# EasyEDA Pro project 基于ESP32智能动植物养护调控系统_2026-06-21.epro, schematic Schematic1
Board Name: Board1; Create Date: 2025-03-10; Page Name: P1; Project Name: 基于ESP32的环境检测器; Schematic Name: Schematic1; Update Date: 2025-03-11; Company: 嘉立创EDA; Page Size: A4; Version: V1.0
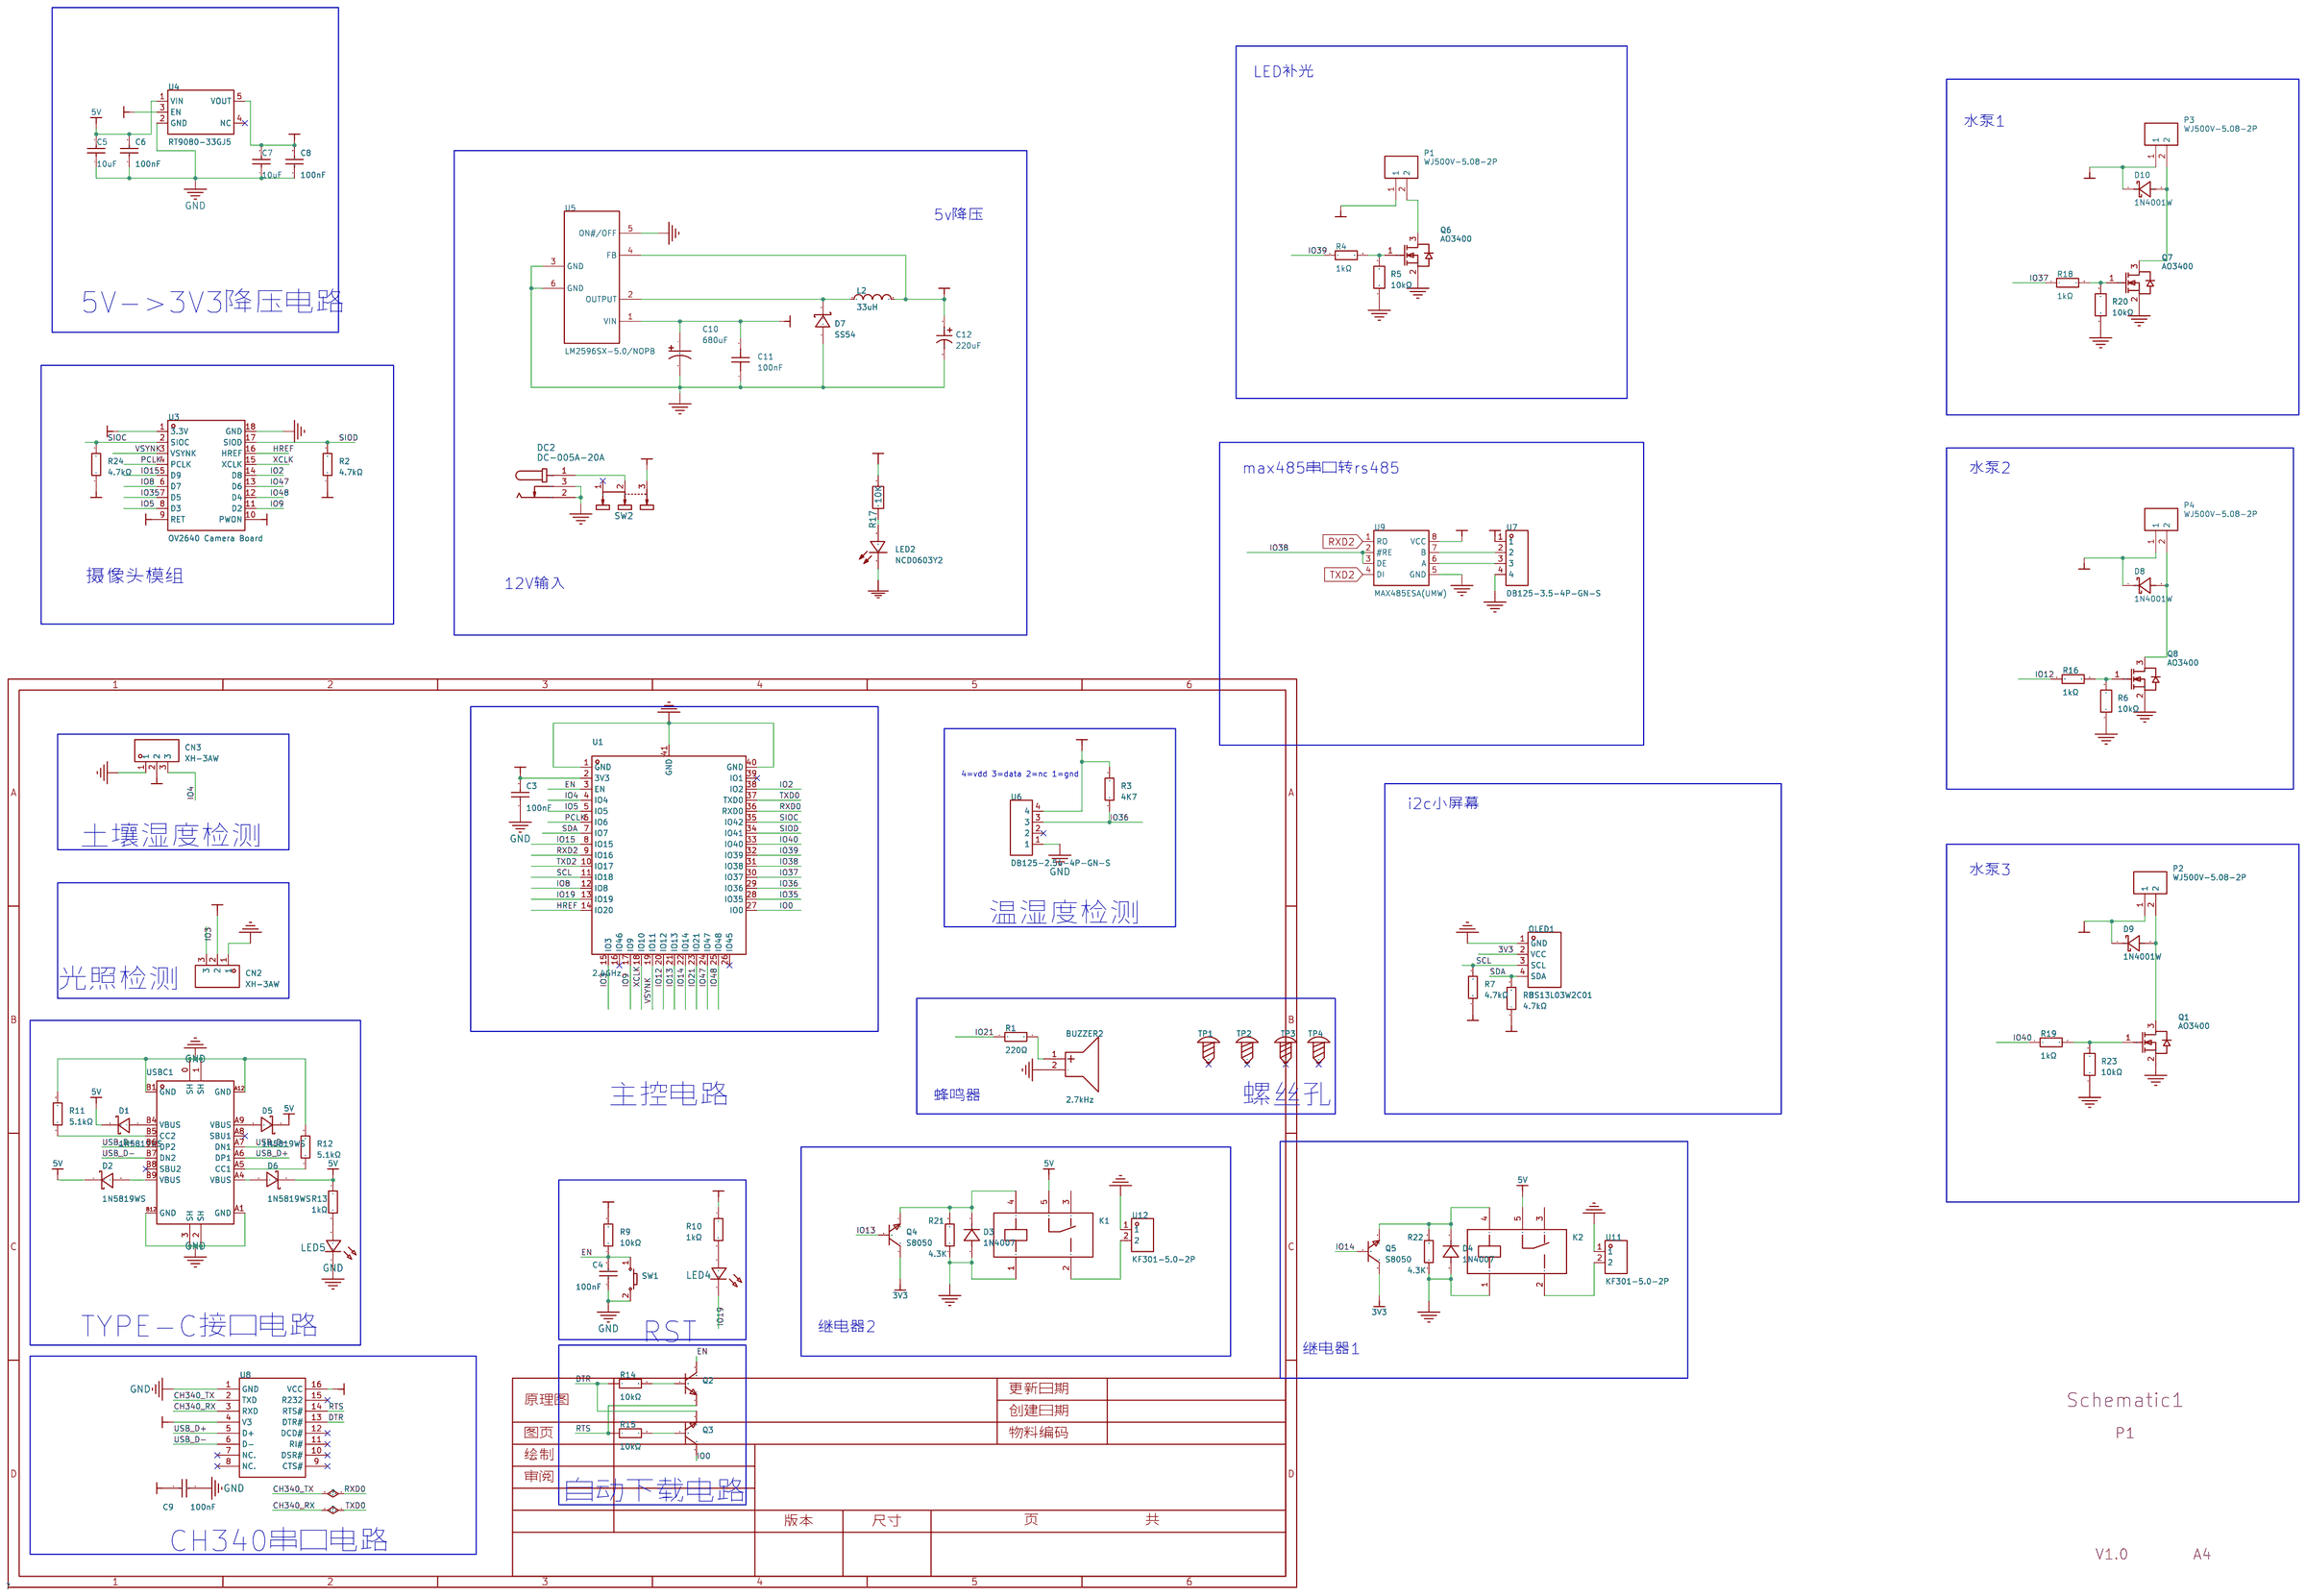
[diagram p0: schematic sheet]

## Parts
BUZZER2  2.7kHz  [BUZ-SMD_GSD9605YB-3V2800]
C3  100nF  [C0805]
C4  100nF  [C0805]
C5  10uF  [C0805]
C6  100nF  [C0805]
C7  10uF  [C0805]
C8  100nF  [C0805]
C9  100nF  [C0805]
C10  680uF  [CAP-SMD_BD12.5-L13.0-W13.0-FD]
C11  100nF  [C0805]
C12  220uF  [CAP-SMD_BD6.3-L6.6-W6.6-LS7.2-FD]
CN2  XH-3AW  [CONN-TH_3P-P2.54_HCTL_XH-3AW]
CN3  XH-3AW  [CONN-TH_3P-P2.54_HCTL_XH-3AW]
D1  1N5819WS  [SOD-323_L1.8-W1.3-LS2.5-RD]
D2  1N5819WS  [SOD-323_L1.8-W1.3-LS2.5-RD]
D3  1N4007  [SMA_L4.3-W2.5-LS5.0-RD]
D4  1N4007  [SMA_L4.3-W2.5-LS5.0-RD]
D5  1N5819WS  [SOD-323_L1.8-W1.3-LS2.5-RD]
D6  1N5819WS  [SOD-323_L1.8-W1.3-LS2.5-RD]
D7  SS54  [SMA_L4.4-W2.8-LS5.4-R-RD]
D8  1N4001W  [SOD-123FL_L2.7-W1.8-LS3.8-RD]
D9  1N4001W  [SOD-123FL_L2.7-W1.8-LS3.8-RD]
D10  1N4001W  [SOD-123FL_L2.7-W1.8-LS3.8-RD]
DC2  DC-005A-20A  [DC-IN-TH_DC-005A-20A]
K1  SRD-03VDC-SL-C  [RELAY-TH_SRD-XXVDC-XL-C]
K2  SRD-03VDC-SL-C  [RELAY-TH_SRD-XXVDC-XL-C]
L2  33uH  [IND-SMD_L7.3-W6.8]
LED2  NCD0603Y2  [LED0603-RD]
LED4  -  [LED_0805]
LED5  -  [LED_0805]
OLED1  HS13L03W2C01  [OLED-TH_L35.4-W33.5_HS13L03W2C01]
P1  WJ500V-5.08-2P  [CONN-TH_2P-P5.00_WJ500V-5.08-2P]
P2  WJ500V-5.08-2P  [CONN-TH_2P-P5.00_WJ500V-5.08-2P]
P3  WJ500V-5.08-2P  [CONN-TH_2P-P5.00_WJ500V-5.08-2P]
P4  WJ500V-5.08-2P  [CONN-TH_2P-P5.00_WJ500V-5.08-2P]
Q1  AO3400  [SOT-23_L2.9-W1.3-P1.90-LS2.4-BR]
Q2  SS8050  [SOT-23-3_L2.9-W1.3-P1.90-LS2.4-BR]
Q3  SS8050  [SOT-23-3_L2.9-W1.3-P1.90-LS2.4-BR]
Q4  S8050  [SOT-23-3_L2.9-W1.3-P1.90-LS2.3-BR]
Q5  S8050  [SOT-23-3_L2.9-W1.3-P1.90-LS2.3-BR]
Q6  AO3400  [SOT-23_L2.9-W1.3-P1.90-LS2.4-BR]
Q7  AO3400  [SOT-23_L2.9-W1.3-P1.90-LS2.4-BR]
Q8  AO3400  [SOT-23_L2.9-W1.3-P1.90-LS2.4-BR]
R1  220Ω  [R0805]
R2  4.7kΩ  [R0805]
R3  4K7  [R0805]
R4  1kΩ  [R0603]
R5  10kΩ  [R0603]
R6  10kΩ  [R0603]
R7  4.7kΩ  [R0805]
R8  4.7kΩ  [R0805]
R9  10kΩ  [R0805]
R10  1kΩ  [R0805]
R11  5.1kΩ  [R0805]
R12  5.1kΩ  [R0805]
R13  1kΩ  [R0805]
R14  10kΩ  [R0805]
R15  10kΩ  [R0805]
R16  1kΩ  [R0603]
R17  10K  [R0603]
R18  1kΩ  [R0603]
R19  1kΩ  [R0603]
R20  10kΩ  [R0603]
R21  4.3K  [R0805]
R22  4.3K  [R0805]
R23  10kΩ  [R0603]
R24  4.7kΩ  [R0805]
SW1  -  [Key_SMD_3.6x6.1x2.5]
SW2  SS-12D10L3  [SW-TH_SS-12D10L3]
TP1  -  [M3螺丝]
TP2  -  [M3螺丝]
TP3  -  [M3螺丝]
TP4  -  [M3螺丝]
U1  2.4GHz  [WIRELM-SMD_ESP32-S3-WROOM-1]
U3  OV2640 Camera Board  [SENSORM-TH_L35.7-W3.9-OV2640]
U4  RT9080-33GJ5  [SOT-23-5_L3.0-W1.5-P0.95-LS2.8-BL]
U5  LM2596SX-5.0/NOPB  [TO-263-5_L10.2-W8.9-P1.70-TL]
U6  DB125-2.54-4P-GN-S  [CONN-TH_DB125-2.54-4P-GN]
U7  DB125-3.5-4P-GN-S  [CONN-TH_DB125-3.5-4P-GN]
U8  CH340C  [SOP-16_L10.0-W3.9-P1.27-LS6.0-BL]
U9  MAX485ESA(UMW)  [SOP-8_L5.0-W4.0-P1.27-LS6.0-BL]
U11  KF301-5.0-2P  [CONN-TH_P5.00_KF301-5.0-2P]
U12  KF301-5.0-2P  [CONN-TH_P5.00_KF301-5.0-2P]
USBC1  TYPE-C-31-M-12  [USB-C_SMD-TYPE-C-31-M-12]

## Library data of the parts
BUZZER2 = GSD9605YB-3V2800: 驱动方式:有源(内含驱动线路);构造类型:电磁式;频率:2.7kHz;声压(SPL):80dB;; LCSC Part Name: 9.6*9.6*5mm电磁有源 3V; Supplier Part: C255327; Manufacturer: INGHAi(赢海); JLCPCB Part Class: Extended Part; Datasheet: https://item.szlcsc.com/datasheet/GSD9605YB-3V2800/249279.html; Supplier: LCSC; Driver Circuitry: 有源(内含驱动线路); Technology: 电磁式; Voltage - Supply: 2V~5V; Sound Pressure Level(SPL): 80dB; Length: 9.6mm; Width: 9.6mm; Height: 5.2mm
C3 C4 C6 C8 C9 = 0805B104K500NT: 容值:100nF;精度:±10%;额定电压:50V;材质(温度系数):X7R;; LCSC Part Name: 100nF±10%50V; Supplier Part: C38141; Manufacturer: FH(风华); Supplier Footprint: 0805; JLCPCB Part Class: ExtendedPart; Datasheet: https://atta.szlcsc.com/upload/public/pdf/source/20170923/C38141_1506149447419988747.pdf; Supplier: LCSC; Tolerance: ±10%; Voltage Rated: 50V; Temperature Coefficient: X7R
C5 C7 = CL21A106KAYNNNE_C15850: 容值:10uF;精度:±10%;额定电压:25V;材质(温度系数):X5R;; LCSC Part Name: 10uF±10%25V; Supplier Part: C15850; Manufacturer: SAMSUNG(三星); Manufacturer Part: CL21A106KAYNNNE; Supplier Footprint: 0805; JLCPCB Part Class: BasicPart; Datasheet: https://atta.szlcsc.com/upload/public/pdf/source/20160103/1457707679302.pdf; Supplier: LCSC; Tolerance: ±10%; Voltage Rated: 25V; Temperature Coefficient: X5R
C10 = 35TLV680M12.5X13.5: 容值:680uF;精度:±20%;额定电压:35V;纹波电流:660mA@120Hz;等效串联电阻:-;; LCSC Part Name: 680uF ±20% 35V; Supplier Part: C201215; Manufacturer: rubycon(红宝石); Supplier Footprint: SMD,D12.5xL13.5mm; JLCPCB Part Class: Extended Part; Datasheet: https://atta.szlcsc.com/upload/public/pdf/source/20180329/C201215_4AB8F271E64CA7663E2E6376398CC492.pdf; Supplier: LCSC; Tolerance: ±20%; Rated Voltage: 35V; Ripple Current: 660mA@120Hz; φD: 12.5mm; L: 13.5mm; Lifetime @ Temp: 5000hrs@105℃; Operating Temperature: -55℃~+105℃
C11 = CAP_0805: Supplier Footprint: 0805
C12 = MVG 16V 220UF 6.3*7.7: 容值:220uF;精度:±20%;额定电压:16V;纹波电流:130mA@120Hz;等效串联电阻(ESR):-;; LCSC Part Name: 220uF ±20% 16V; Supplier Part: C2827940; Manufacturer: SAMYOUNG(韩国三莹); Supplier Footprint: SMD,D6.3xL7.7mm; JLCPCB Part Class: Extended Part; Datasheet: https://item.szlcsc.com/datasheet/MVG%252016V%2520220UF%25206.3*7.7/2975110.html; Supplier: LCSC; Tolerance: ±20%; Voltage Rating: 16V; Ripple Current: 130mA@120Hz; Diameter: 6.3mm; Height - Seated (Max): 7.7mm; Lifetime: 2000hrs@85℃; Operating Temperature: -40℃~+85℃
CN2 CN3 = XH-3AW_C2908612: 插针结构:1x3P;间距:2.54mm;安装方式:弯插;参考系列:XH;总PIN数:3P;排数:1;每排PIN数:3;行距:-;额定电流:3A;触头材质:黄铜;触头镀层:锡;工作温度:-25℃~+85℃;; LCSC Part Name: 1x3P 间距:2.54mm 弯插 系列:XH; Supplier Part: C2908612; Manufacturer: HCTL(华灿天禄); Supplier Footprint: 弯插,P=2.5mm; JLCPCB Part Class: Extended Part; Datasheet: https://item.szlcsc.com/datasheet/XH-3AW/3184383.html; Supplier: LCSC; Pins Structure: 1x3P; Pitch: 2.54mm; Mounting Type: 弯插; Reference Series: XH; Number of Pins: 3P; Number of Rows: 1; Number of PINs Per Row: 3; Current Rating: 3A; Contact Material: 黄铜; Contact Plating: 锡; Operating Temperature: -25℃~+85℃; Voltage Rating: 250V; Plastic Material: PA66; Flame Retardant Rating: UL94V-0; Z-Height of the Board: 5.9mm; Y-Width of Bottom Edge on Board: 7mm
D1 D2 D5 D6 = 1N5819WS_C191023: 正向压降(Vf):600mV@1A;直流反向耐压(Vr):40V;整流电流:1A;; LCSC Part Name: 电压:40V 电流:1A; Supplier Part: C191023; Manufacturer: Hottech(合科泰); Supplier Footprint: SOD-323; JLCPCB Part Class: Basic Part; Datasheet: https://item.szlcsc.com/datasheet/1N5819WS/213850.html; Supplier: LCSC; Voltage - Forward(Vf@If): 600mV@1A; Voltage - DC Reverse(Vr): 40V; Current - Rectified: 1A; Non-Repetitive Peak Forward Surge Current: 25A
D3 D4 = 1N4007_C727081: 二极管配置:独立式;正向压降(Vf):1.1V@1A;直流反向耐压(Vr):1kV;整流电流:1A;; Supplier Part: C727081; Manufacturer: TWGMC(台湾迪嘉); Supplier Footprint: SMA(DO-214AC); JLCPCB Part Class: 扩展库; Datasheet: https://atta.szlcsc.com/upload/public/pdf/source/20200828/C727079_3A05254382567072883400655AE0ED46.pdf; Supplier: LCSC; Diode Configuration: 独立式; Forward Voltage (Vf@If): 1.1V@1A; Reverse Voltage (Vr): 1kV; Rectified Current: 1A; Reverse Leakage Current (Ir): 5uA
D7 = SS54_C22452: 二极管配置:独立式;正向压降(Vf):550mV@5A;直流反向耐压(Vr):40V;整流电流:5A;; LCSC Part Name: 电压:40V 电流:5A; Supplier Part: C22452; Manufacturer: MDD(辰达半导体); Supplier Footprint: SMA(DO-214AC); JLCPCB Part Class: Basic Part; Datasheet: https://item.szlcsc.com/datasheet/SS54/23178.html; Supplier: LCSC; Diode Configuration: 独立式; Voltage - Forward(Vf@If): 550mV@5A; Voltage - DC Reverse(Vr): 40V; Current - Rectified: 5A; Reverse Leakage Current (Ir): 1mA@40V; Operating Junction Temperature Range: -55℃~+125℃
D8-D10 = 1N4001W_C18199085: 二极管配置:独立式;正向压降(Vf):1V@1.0A;直流反向耐压(Vr):50V;整流电流:1A;; Supplier Part: C18199085; Manufacturer: R+O(宏嘉诚); Supplier Footprint: SOD-123FL; JLCPCB Part Class: Extended Part; Datasheet: https://item.szlcsc.com/datasheet/1N4001W/19354317.html; Supplier: LCSC; Diode Configuration: 独立式; Voltage - Forward(Vf@If): 1V@1.0A; Voltage - DC Reverse(Vr): 50V; Current - Rectified: 1A; Reverse Leakage Current (Ir): 2uA@50V; Non-Repetitive Peak Forward Surge Current: 30A; Operating Junction Temperature Range: -55℃~+150℃
DC2 = DC-005A-20A: Supplier: LCSC; Supplier Part: C191049; Manufacturer: Rectangular Connectors - Contacts; JLCPCB Part Class: Extended Part
K1 K2 = SRD-03VDC-SL-C: 线圈电压:3V;触点形式:一组转换:1C(单刀双掷-转换);触点容量(电阻负载):-;最大切换电压:250V@AC;最大切换电流:15A;; LCSC Part Name: 蓝色; Supplier Part: C24585; Manufacturer: 松乐; Supplier Footprint: 插件,15.6x19.2mm; JLCPCB Part Class: 扩展库; Datasheet: https://atta.szlcsc.com/upload/public/pdf/source/20200305/C490149_C96E4098A3B1FFB377D5AD2E40B7C2A8.pdf; Supplier: LCSC; Coil Voltage: 3V; Contact Form: 一组转换:1C(单刀双掷-转换); Pin Number: 5; Maximum Switching Voltage: 250V@AC; Coil Rated Power: 360mW; Maximum Switching Current: 15A; Coil Type: 无极性-单线圈; Contact Resistance: 100mΩ; Operate Time: 10ms; Release Time: 10ms
L2 = FXL0630-100-M: 电感值:10uH;精度:±20%;额定电流:4.5A;饱和电流(Isat):5.5A;类型:一体成型电感;; LCSC Part Name: 10uH ±20% 5.5A; Supplier Part: C167223; Manufacturer: cjiang(长江微电); Supplier Footprint: SMD,7x6.6mm; JLCPCB Part Class: Extended Part; Datasheet: https://item.szlcsc.com/datasheet/FXL0630-100-M/178606.html; Supplier: LCSC; Tolerance: ±20%; Current Rating: 4.5A; Current - Saturation(Isat): 5.5A; DC Resistance(DCR): 68mΩ; Type: 一体成型电感
LED2 = NCD0603Y2: 灯头类型:-;发光颜色:黄色;正向压降(Vf):1.6V~2.6V;功率:65mW;正向电流:25mA;波长:586nm~595nm;二极管配置:独立二极管;透镜颜色:-;色温:-;发光强度:220mcd;发光角度:130°;载带方式:-;工作温度:-30℃~+85℃;; LCSC Part Name: 片式发光二极管; Supplier Part: C89811; Manufacturer: 国星光电; Supplier Footprint: 0603; JLCPCB Part Class: Extended Part; Datasheet: https://item.szlcsc.com/datasheet/NCD0603Y2/90993.html; Supplier: LCSC; Illumination Color: 黄色; Voltage - Forward(Vf): 1.6V~2.6V; Power(Watts): 65mW; Forward Current: 25mA; Wavelength - Dominant: 586nm~595nm; Peak Wavelength: 595nm; Diode Configuration: 独立二极管; Luminous Intensity: 220mcd; Viewing Angle: 130°; Operating Temperature: -30℃~+85℃
LED4 LED5 = LED_0805-R: Supplier Footprint: 0805; Supplier Part: C84256
OLED1 = HS13L03W2C01: 主控芯片:SH1106;接口类型:I2C;尺寸(inch):1.3;; LCSC Part Name: 1.3'1.3寸 128*64 OLED显示屏 I2C通讯 SH1106 白光; Supplier Part: C7465997; Manufacturer: HS(汉昇); JLCPCB Part Class: Extended Part; Datasheet: https://atta.szlcsc.com/upload/public/pdf/source/20230720/8731A47396DED074CDCD72E9ACEFB46F.pdf; Supplier: LCSC; Main Control Chip: SH1106; Interface Type: I2C; Size: 1.3; Operating Temperature: -40℃~+70℃
P1-P4 = WJ500V-5.08-2P: 结构:1x2P;间距:5.08mm;颜色:绿色;安装方式:直插;额定电流:18A;额定电压:250V;排数:1;线规 - AWG:14~30;线规 - 平方毫米:2.5;每排PIN数:2;触头材质:-;触头镀层:-;工作温度范围:-40℃~+105℃;焊接温度(最大值):-;; LCSC Part Name: 1x2P 5.08mm 直插 排数:1 每排P数:2; Supplier Part: C8465; Manufacturer: KANGNEX(康奈克斯电气); Supplier Footprint: 插件,P=5.08mm; JLCPCB Part Class: Extended Part; Datasheet: https://atta.szlcsc.com/upload/public/pdf/source/20191225/C8465_02D34CE5B5B4A53DF5891601D97FA9F4.pdf; Supplier: LCSC; Structure: 1x2P; Pitch: 5.08mm; Color: 绿色; Mounting Style: 直插; Current Rating (Max): 18A; Voltage Rating (Max): 250V; Number of Pins: 2P; Number of Rows: 1; Wire Gauge - AWG: 14~30; Wire Gauge - mm2: 2.5; Number of PINs Per Row: 2; Operating Temperature Range: -40℃~+105℃; Screw Specification: M2.5
Q1 Q6-Q8 = AO3400_C2938367: 数量:1个N沟道;漏源电压(Vdss):30V;连续漏极电流(Id):5.8A;导通电阻(RDS(on)):28mΩ@10V;耗散功率(Pd):1.5W;阈值电压(Vgs(th)):1.4V@250uA;; LCSC Part Name: 1个N沟道 耐压:30V 电流:5.8A; Supplier Part: C2938367; Manufacturer: GOODWORK(固得沃克); Supplier Footprint: SOT-23; JLCPCB Part Class: Extended Part; Datasheet: https://item.szlcsc.com/datasheet/AO3400/3294704.html; Supplier: LCSC; Number: 1个N沟道; Drain to Source Voltage: 30V; Current - Continuous Drain(Id): 5.8A; RDS(on): 28mΩ@10V; Pd - Power Dissipation: 1.5W; Gate Threshold Voltage (Vgs(th)): 1.4V@250uA; Input Capacitance(Ciss): 1.05nF; Reverse Transfer Capacitance (Crss@Vds): 77pF@15V; Operating Temperature: -55℃~+150℃; Type: N沟道
Q2 Q3 = SS8050_C2150: 晶体管类型:NPN;集射极击穿电压(Vceo):25V;集电极电流(Ic):1.5A;功率(Pd):300mW;直流电流增益(hFE@Ic,Vce):200@100mA,1V;; LCSC Part Name: NPN25V1.5AY1200-350; Supplier Part: C2150; Manufacturer: CJ(江苏长电/长晶); Supplier Footprint: SOT-23; JLCPCB Part Class: BasicPart; Datasheet: https://atta.szlcsc.com/upload/public/pdf/source/20230322/AEE86F4B043774EFF80CAEA14A37D9E9.pdf; Supplier: LCSC; Transistor Type: NPN; Collector-Emitter Breakdown Voltage (Vceo): 25V; Collector Current (Ic): 1.5A; Power Dissipation (Pd): 300mW; Collector Cut-Off Current (Icbo): 100nA; Collector-Emitter Saturation Voltage (VCE(sat)@Ic,Ib): 500mV@800mA,80mA; DC Current Gain (hFE@Ic,Vce): 200@100mA,1V; Transition Frequency (fT): 100MHz; Operating Temperature: +150℃@(Tj)
Q4 Q5 = S8050_C20069125: 晶体管类型:NPN;集电极电流(Ic):500mA;集射极击穿电压(Vceo):25V;耗散功率(Pd):300mW;直流电流增益(hFE):120@50mA,1.0V;; LCSC Part Name: hFE:200-350，丝印:J3Y S8050; Supplier Part: C20069125; Manufacturer: 宏嘉诚; Supplier Footprint: SOT-23; JLCPCB Part Class: 扩展库; Datasheet: https://atta.szlcsc.com/upload/public/pdf/source/20250107/343E8B94B5C24D0D65D7D4B70E0B73F6.pdf; Supplier: LCSC; type: NPN; Current - Collector(Ic): 500mA; Collector - Emitter Voltage VCEO: 25V; Pd - Power Dissipation: 300mW; DC Current Gain: 120@50mA,1.0V; Transition frequency(fT): 100MHz; Current - Collector Cutoff: 100nA; Vce Saturation(VCE(sat)): 600mV; Operating Temperature: -55℃~+150℃
R1 = 0805W8F2200T5E: 电阻类型:厚膜电阻;阻值:220Ω;精度:±1%;功率:125mW;工作电压:150V;温度系数:±100ppm/℃;; LCSC Part Name: 220Ω ±1% 125mW 厚膜电阻; Supplier Part: C17557; Manufacturer: UNI-ROYAL(厚声); Supplier Footprint: 0805; JLCPCB Part Class: Basic Part; Datasheet: https://item.szlcsc.com/datasheet/0805W8F2200T5E/18245.html; Supplier: LCSC; Type: 厚膜电阻; Tolerance: ±1%; Power(Watts): 125mW; Voltage-Supply(Max): 150V; Temperature Coefficient: ±100ppm/℃; Operating Temperature: -55℃~+155℃
R2 R7 R8 R24 = 0805W8F4701T5E: 电阻类型:厚膜电阻;阻值:4.7kΩ;精度:±1%;功率:125mW;最大工作电压:150V;温度系数:±100ppm/℃;; LCSC Part Name: 4.7kΩ ±1% 125mW 厚膜电阻; Supplier Part: C17673; Manufacturer: UNI-ROYAL(厚声); Supplier Footprint: 0805; JLCPCB Part Class: Basic Part; Datasheet: https://atta.szlcsc.com/upload/public/pdf/source/20200306/C422600_1E6D84923E4A46A82E41ADD87F860B5C.pdf; Supplier: LCSC; Type: 厚膜电阻; Tolerance: ±1%; Power(Watts): 125mW; Overload Voltage (Max): 150V; Temperature Coefficient: ±100ppm/℃; Operating Temperature Range: -55℃~+155℃
R3 R21 R22 = Res_0805: Supplier Footprint: 0805
R4 R16 R18 R19 = 0603WAF1001T5E: 电阻类型:厚膜电阻;阻值:1kΩ;精度:±1%;功率:100mW;工作电压:75V;温度系数:±100ppm/℃;; LCSC Part Name: 1kΩ ±1% 100mW 厚膜电阻; Supplier Part: C21190; Manufacturer: UNI-ROYAL(厚声); Supplier Footprint: 0603; JLCPCB Part Class: Basic Part; Datasheet: https://item.szlcsc.com/datasheet/0603WAF1001T5E/21904.html; Supplier: LCSC; Type: 厚膜电阻; Tolerance: ±1%; Power(Watts): 100mW; Voltage-Supply(Max): 75V; Temperature Coefficient: ±100ppm/℃; Operating Temperature: -55℃~+155℃
R5 R6 R20 R23 = FRC0603F1002TS: 电阻类型:厚膜电阻;阻值:10kΩ;精度:±1%;功率:100mW;工作电压:75V;温度系数:±100ppm/℃;; LCSC Part Name: 10kΩ ±1% 100mW 厚膜电阻; Supplier Part: C2906982; Manufacturer: FOJAN(富捷); Supplier Footprint: 0603; JLCPCB Part Class: Extended Part; Supplier: LCSC; Type: 厚膜电阻; Tolerance: ±1%; Power(Watts): 100mW; Voltage-Supply(Max): 75V; Temperature Coefficient: ±100ppm/℃; Operating Temperature: -55℃~+155℃
R9 R14 R15 = 0805W8F1002T5E_C17414: 电阻类型:厚膜电阻;阻值:10kΩ;精度:±1%;功率:125mW;; LCSC Part Name: 10kΩ±1%125mW; Supplier Part: C17414; Manufacturer: UNI-ROYAL(厚声); Manufacturer Part: 0805W8F1002T5E; Supplier Footprint: 0805; JLCPCB Part Class: BasicPart; Datasheet: https://atta.szlcsc.com/upload/public/pdf/source/20200306/C422600_1E6D84923E4A46A82E41ADD87F860B5C.pdf; Supplier: LCSC; Type: 厚膜电阻; Tolerance: ±1%; Power(Watts): 125mW; Temperature Coefficient: ±100ppm/℃; Overload Voltage (Max): 150V; Operating Temperature Range: -55℃~+155℃
R10 R13 = 0805W8F1001T5E: 电阻类型:厚膜电阻;阻值:1kΩ;精度:±1%;功率:125mW;; LCSC Part Name: 1kΩ±1%125mW; Supplier Part: C17513; Manufacturer: UNI-ROYAL(厚声); Supplier Footprint: 0805; JLCPCB Part Class: BasicPart; Datasheet: https://atta.szlcsc.com/upload/public/pdf/source/20200306/C422600_1E6D84923E4A46A82E41ADD87F860B5C.pdf; Supplier: LCSC; Type: 厚膜电阻; Tolerance: ±1%; Power(Watts): 125mW; Temperature Coefficient: ±100ppm/℃; Overload Voltage (Max): 150V; Operating Temperature Range: -55℃~+155℃
R11 R12 = 0805W8F5101T5E: 电阻类型:厚膜电阻;阻值:5.1kΩ;精度:±1%;功率:125mW;; LCSC Part Name: 5.1kΩ ±1% 125mW; Supplier Part: C27834; Manufacturer: UNI-ROYAL(厚声); Supplier Footprint: 0805; JLCPCB Part Class: 基础库; Datasheet: https://atta.szlcsc.com/upload/public/pdf/source/20200306/C422600_1E6D84923E4A46A82E41ADD87F860B5C.pdf; Supplier: LCSC; Type: 厚膜电阻; Tolerance: ±1%; Power(Watts): 125mW; Temperature Coefficient: ±100ppm/℃; Overload Voltage (Max): 150V; Operating Temperature Range: -55℃~+155℃
R17 = 10K
SW1 = Key_SMD_3.6x6.1x2.5: Supplier Footprint: SMD; Supplier Part: C118141
SW2 = SS-12D10L3: Supplier: LCSC; Supplier Part: C319013; Manufacturer: XKB Enterprise; JLCPCB Part Class: Extended Part
TP1-TP4 = M3螺丝: Supplier Footprint: 插件
U1 = ESP32-S3-WROOM-1-N8R8: 核心芯片:ESP32-S3R8;频率:2.4GHz;天线形式:板载PCB天线;发射功率:20.5dBm;接收灵敏度:-104.5dBm;; LCSC Part Name: 不带固件 2.4GHz Wi-Fi (802.11b/g/n) + 蓝牙 5 (LE) 模组; Supplier Part: C2913201; Manufacturer: ESPRESSIF(乐鑫); Supplier Footprint: SMD,25.5x18mm; JLCPCB Part Class: Extended Part; Datasheet: https://item.szlcsc.com/datasheet/ESP32-S3-WROOM-1-N8R8/3198299.html; Supplier: LCSC; Utilized IC / Part: ESP32-S3R8; Wireless Standard: Bluetooth5.0; Interface Type: I2C；GPIO；UART；SPI；USB；I2S; Antenna Type: 板载PCB天线; Output Power: 20.5dBm; Voltage - Supply: 3V~3.6V; Receive  Current: 97mA; Send  Current: 330mA; Sensitivity: -104.5dBm; Operating Temperature: -40℃~+65℃
U3 = OV2640 Camera Board: 供电电压：3.3V / IO电压：1.7V ~3.3V DC; LCSC Part Name: OV2640摄像头 OV2640模块 OV2640摄像头 采集模组 200万像素; Supplier Part: C359962; Manufacturer: Waveshare(微雪电子); JLCPCB Part Class: Extended Part; Datasheet: https://atta.szlcsc.com/upload/public/pdf/source/20190107/C359962_8F9E613A403684C90116CB7314EC2612.pdf; Supplier: LCSC
U4 = RT9080-33GJ5_C20617299: 输出类型:固定;工作电压:5.5V;输出电压:3.3V;输出电流:600mA;电源纹波抑制比(PSRR):75dB@(1kHz);输出极性:正极;; LCSC Part Name: 600mA、2uA，高电源抑制比（PSRR）电压调节器; Supplier Part: C20617299; Manufacturer: TECH PUBLIC(台舟); Supplier Footprint: SOT-23-5; JLCPCB Part Class: Extended Part; Datasheet: https://item.szlcsc.com/datasheet/RT9080-33GJ5/21989445.html; Supplier: LCSC; Output Type: 固定; Voltage - Supply: 5.5V; Output Voltage: 3.3V; Output Current: 600mA; Power Supply Rejection Ratio (PSRR): 75dB@(1kHz); Voltage Dropout: 320mV@(600mA); standby current: 2uA; Noise: 50uVrms; Features: 带使能；过热保护; Operating Temperature: -40℃~+85℃@(Ta); Output Configuration: 正极; Number of Outputs: 1
U5 = LM2596SX-5.0/NOPB: 功能类型:降压型;工作电压:4.5V~40V;输出电压:5V;输出电流:3A;输出类型:固定;; LCSC Part Name: 降压型 3A 4.5V~40V; Supplier Part: C10002; Manufacturer: TI(德州仪器); Supplier Footprint: TO-263-5; JLCPCB Part Class: Extended Part; Datasheet: https://www.ti.com/cn/lit/gpn/lm2596; Supplier: LCSC; Function: 降压型; Voltage - Supply: 4.5V~40V; Output Voltage: 5V; Output Current: 3A; Frequency - Switching: 150kHz; Operating Temperature: -40℃~+125℃@(TJ); Synchronous Rectifier: 否; Number of Outputs: 1; Topology: 降压式; Switch tube (built-in/external): 内置; Output Type: 固定
U6 = DB125-2.54-4P-GN-S: 结构:1x4P;间距:2.54mm;颜色:绿色;安装方式:直插;排数:1;每排PIN数:4;额定电流:7A;额定电压:150V;线规 - AWG:18~26;线规 - 平方毫米:1;工作温度:-40℃~+105℃;; LCSC Part Name: 1x4P 2.54mm 直插 排数:1 每排P数:4; Supplier Part: C918122; Manufacturer: DORABO(地博电气); Supplier Footprint: 插件,P=2.54mm; JLCPCB Part Class: Extended Part; Datasheet: https://item.szlcsc.com/datasheet/DB125-2.54-4P-GN-S/993701.html; Supplier: LCSC; Number of Positions or Pins: 1x4P; Pitch: 2.54mm; Color: 绿色; Mounting Type: 直插; Number of Pins: 4P; Number of Rows: 1; Number of PINs Per Row: 4; Current Rating: 7A; Voltage Rating (Max): 150V; Wire Gauge - AWG: 18~26; Wire Gauge - mm2: 1; Operating Temperature: -40℃~+105℃
U7 = DB125-3.5-4P-GN-S: 结构:1x4P;间距:3.5mm;颜色:绿色;安装方式:直插;排数:1;每排PIN数:4;额定电流:10A;额定电压:300V;线规 - AWG:16~28;线规 - 平方毫米:1;工作温度:-40℃~+105℃;; LCSC Part Name: 1x4P 3.5mm 直插 排数:1 每排P数:4; Supplier Part: C2757925; Manufacturer: DORABO(地博电气); Supplier Footprint: 插件,P=3.5mm; JLCPCB Part Class: Extended Part; Datasheet: https://item.szlcsc.com/datasheet/DB125-3.5-4P-GN-S/2874766.html; Supplier: LCSC; Number of Positions or Pins: 1x4P; Pitch: 3.5mm; Color: 绿色; Mounting Type: 直插; Number of Pins: 4P; Number of Rows: 1; Number of PINs Per Row: 4; Screw Specification: M2; Current Rating: 10A; Voltage Rating (Max): 300V; Wire Gauge - AWG: 16~28; Wire Gauge - mm2: 1; Operating Temperature: -40℃~+105℃
U8 = CH340C: 应用功能:Transceiver;接口协议:USB 2.0;数据速率:2Mbps;供电电压:3.3V；5V;; Supplier Part: C84681; Manufacturer: WCH(南京沁恒); Supplier Footprint: SOP-16; JLCPCB Part Class: ExtendedPart; Datasheet: https://atta.szlcsc.com/upload/public/pdf/source/20200819/C84681_ADBED554CE321879DBD6B1D06488689C.pdf; Supplier: LCSC; Applications Function: Transceiver; Protocol: USB2.0; Data Rate: 2Mbps; Supply Voltage: 3.3V；5V
U9 = MAX485ESA(UMW): 类型:收发器;数据速率:2.5Mbps;; LCSC Part Name: 低功耗、压摆率受限的RS-485/RS-422收发器; Supplier Part: C668206; Manufacturer: UMW(友台半导体); Supplier Footprint: SOP-8; JLCPCB Part Class: Extended Part; Datasheet: https://item.szlcsc.com/datasheet/MAX485ESA(UMW)/698054.html; Supplier: LCSC; Type: 收发器; Number of Drivers: 1; Number of Receivers: 1; Voltage - Supply: 5V; Data Rate: 2.5Mbps; Number of Nodes: 32; Supply Current (Iq): 300uA; Communication Mode: 半双工
U11 U12 = KF301-5.0-2P: 结构:1x2P;间距:5mm;颜色:蓝色;安装方式:直插;额定电流:17A;额定电压:250V;排数:1;线规 - AWG:14~22;线规 - 平方毫米:1.5;每排PIN数:2;工作温度范围:-30℃~+120℃;; LCSC Part Name: 5mm 1x2P 排数:1 每排P数:2 直插; Supplier Part: C474881; Manufacturer: KEFA(科发); Supplier Footprint: 插件,P=5mm; JLCPCB Part Class: 扩展库; Datasheet: https://atta.szlcsc.com/upload/public/pdf/source/20230317/03A5B5FC229D6F9225E8F51DA1A4E80A.pdf; Supplier: LCSC; Structure: 1x2P; Pitch: 5mm; Color: 蓝色; Mounting Style: 直插; Current Rating (Max): 17A; Voltage Rating (Max): 250V; Number of Pins: 2P; Number of Rows: 1; Wire Gauge - AWG: 14~22; Wire Gauge - mm2: 1.5; Number of PINs Per Row: 2; Operating Temperature Range: -30℃~+120℃
USBC1 = TYPE-C-31-M-12: 连接器类型:Type-C;标准:-;公母:母座;触点数量:16;端口数量:1;安装方式:-;额定电流 - 电源:5A;触头材质:-;触头镀层:-;工作温度范围:-;焊接温度(最大值):-;; LCSC Part Name: Type-C母座; Supplier Part: C165948; Manufacturer: 韩国韩荣; Supplier Footprint: SMD; JLCPCB Part Class: ExtendedPart; Datasheet: https://atta.szlcsc.com/upload/public/pdf/source/20220525/466408E853115E789EDB0DDC29077C05.pdf; Supplier: LCSC; Connector Type: Type-C; Gender: 母座; Number of Contacts: 16; Number of Ports: 1; Current Rating - Power (Max): 5A

## Nets
3V3: C3.2 C7.2 C8.2 C9.1 CN2.2 CN3.2 OLED1.2(VCC) Q4.3(C) Q5.3(C) R2.1 R7.1 R8.1 R9.2 R10.1 R24.1 U1.2(3V3) U3.1(3.3V) U3.9(RET) U3.10(PWON) U4.5(VOUT) U8.4(V3) U8.16(VCC)
5V: C5.2 C6.2 C12.1 D1.1(K) D2.1(K) D5.1(K) D6.1(K) D8.1(K) D9.1(K) D10.1(K) K1.5 K2.5 L2.2 P2.1 P3.1 P4.1 R3.1 R13.1 R17.2 U4.1(VIN) U4.3(EN) U5.4(FB) U6.4 U9.8(VCC)
12V: C10.1 C11.2 P1.1 SW2.3 U5.1(VIN) U7.1
GND: BUZZER2.2(-) C3.1 C4.1 C5.1 C6.1 C7.1 C8.1 C9.2 C10.2 C11.1 C12.2 CN2.1 CN3.1 D3.2(A) D4.2(A) D7.1(A) DC2.2 DC2.3 K1.1 K2.1 LED2.1(K) LED5.1(C) OLED1.1(GND) Q1.2(S) Q6.2(S) Q7.2(S) Q8.2(S) R5.1 R6.1 R11.2 R12.2 R20.1 R21.1 R22.1 R23.1 SW1.2 U1.1(GND) U1.40(GND) U1.41(GND) U3.18(GND) U4.2(GND) U5.3(GND) U5.5(ON#/OFF) U5.6(GND) U6.1 U7.4 U8.1(GND) U9.5(GND) U11.1 U12.1 USBC1.0(SH) USBC1.1(SH) USBC1.2(SH) USBC1.3(SH) USBC1.A1(GND) USBC1.A12(GND) USBC1.B1(GND) USBC1.B12(GND)
CH340_RX: U1.37(TXD0) U8.3(RXD)
CH340_TX: U1.36(RXD0) U8.2(TXD)
DTR: Q3.2(E) R14.1 U8.13(DTR#)
EN: C4.2 Q2.3(C) R9.1 SW1.1 U1.3(EN)
HREF: U1.14(IO20) U3.16(HREF)
IO0: Q3.3(C) U1.27(IO0)
IO2: U1.38(IO2) U3.14(D8)
IO3: CN2.3 U1.15(IO3)
IO4: CN3.3 U1.4(IO4)
IO5: U1.5(IO5) U3.8(D3)
IO8: U1.12(IO8) U3.6(D7)
IO9: U1.17(IO9) U3.11(D2)
IO12: R16.1 U1.20(IO12)
IO13: Q4.1(B) U1.21(IO13)
IO14: Q5.1(B) U1.22(IO14)
IO15: U1.8(IO15) U3.5(D9)
IO19: LED4.1(C) U1.13(IO19)
IO21: R1.1 U1.23(IO21)
IO35: U1.28(IO35) U3.7(D5)
IO36: R3.2 U1.29(IO36) U6.3
IO37: R18.1 U1.30(IO37)
IO38: U1.31(IO38) U9.2(#RE) U9.3(DE)
IO39: R4.1 U1.32(IO39)
IO40: R19.1 U1.33(IO40)
IO47: U1.24(IO47) U3.13(D6)
IO48: U1.25(IO48) U3.12(D4)
PCLK: U1.6(IO6) U3.4(PCLK)
RTS: Q2.2(E) R15.1 U8.14(RTS#)
RXD2: U1.9(IO16) U9.1(RO)
SCL: OLED1.3(SCL) R7.2 U1.11(IO18)
SDA: OLED1.4(SDA) R8.2 U1.7(IO7)
SIOC: R24.2 U1.35(IO42) U3.2(SIOC)
SIOD: R2.2 U1.34(IO41) U3.17(SIOD)
TXD2: U1.10(IO17) U9.4(DI)
USB_D+: U8.5(D+) USBC1.A6(DP1) USBC1.B6(DP2)
USB_D-: U8.6(D-) USBC1.A7(DN1) USBC1.B7(DN2)
VSYNK: U1.19(IO11) U3.3(VSYNK)
XCLK: U1.18(IO10) U3.15(XCLK)
$1N4222: Q2.1(B) R14.2
$1N4223: Q3.1(B) R15.2
$1N4230: LED5.2(A) R13.2
$1N4298: R11.1 USBC1.B5(CC2)
$1N4299: R12.1 USBC1.A5(CC1)
$1N6304: LED4.2(A) R10.2
$1N16950: D3.1(K) K1.4 Q4.2(E) R21.2
$1N17190: D4.1(K) K2.4 Q5.2(E) R22.2
$1N17359: K1.2 U12.2
$1N17369: K2.2 U11.2
$1N17603: BUZZER2.1(+) R1.2
$1N17605: D2.2(A) USBC1.B9(VBUS)
$1N17607: D1.2(A) USBC1.B4(VBUS)
$1N17610: D5.2(A) USBC1.A9(VBUS)
$1N17613: D6.2(A) USBC1.A4(VBUS)
$1N17648: LED2.2(A) R17.1
$1N17654: DC2.1 SW2.2
$1N17672: D7.2(K) L2.1 U5.2(OUTPUT)
$1N17696: U7.2 U9.7(B)
$1N17697: U7.3 U9.6(A)
$1N17715: P1.2 Q6.3(D)
$1N17721: Q6.1(G) R4.2 R5.2
$1N17723: D9.2(A) P2.2 Q1.3(D)
$1N17724: D10.2(A) P3.2 Q7.3(D)
$1N17725: D8.2(A) P4.2 Q8.3(D)
$1N17736: Q1.1(G) R19.2 R23.2
$1N17738: Q7.1(G) R18.2 R20.2
$1N17740: Q8.1(G) R6.2 R16.2

Not connected (* = marked no-connect by the designer): K1 3; K2 3; SW2 1*; TP1 1*; TP2 1*; TP3 1*; TP4 1*; U1 16(IO46)* 26(IO45)* 39(IO1)*; U4 4(NC)*; U6 2*; U8 7(NC.)* 8(NC.)* 9(CTS#)* 10(DSR#)* 11(RI#)* 12(DCD#)* 15(R232)*; USBC1 A8(SBU1)* B8(SBU2)*

## Notes on the sheet
- LED补光
- 水泵1
- 5v降压
- 5V->3V3降压电路
- max485串口转rs485
- 水泵2
- 摄像头模组
- 12V输入
- 4=vdd 3=data 2=nc 1=gnd
- i2c小屏幕
- 土壤湿度检测
- 水泵3
- 温湿度检测
- 光照检测
- 蜂鸣器
- 主控电路
- 螺丝孔
- TYPE-C接口电路
- 继电器2
- RST
- 继电器1
- 自动下载电路
- CH340串口电路
